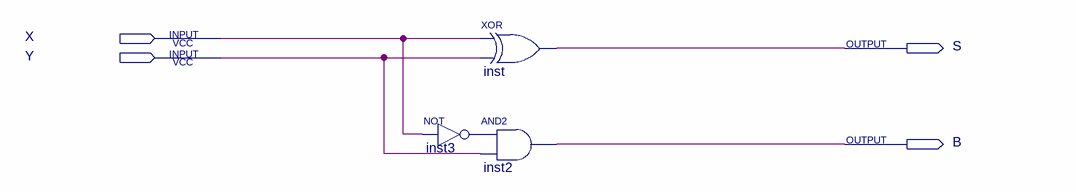
[diagram p0: schematic sheet]
// Quartus schematic Meio-Subtrador.bdf as structural Verilog: 3 symbols, 4 pins
module \Meio-Subtrador  (
  input  X,
  input  Y,
  output S,
  output B
);

  wire inst3_out;

  xor inst (S, X, Y);
  and inst2 (B, inst3_out, Y);
  not inst3 (inst3_out, X);
endmodule
